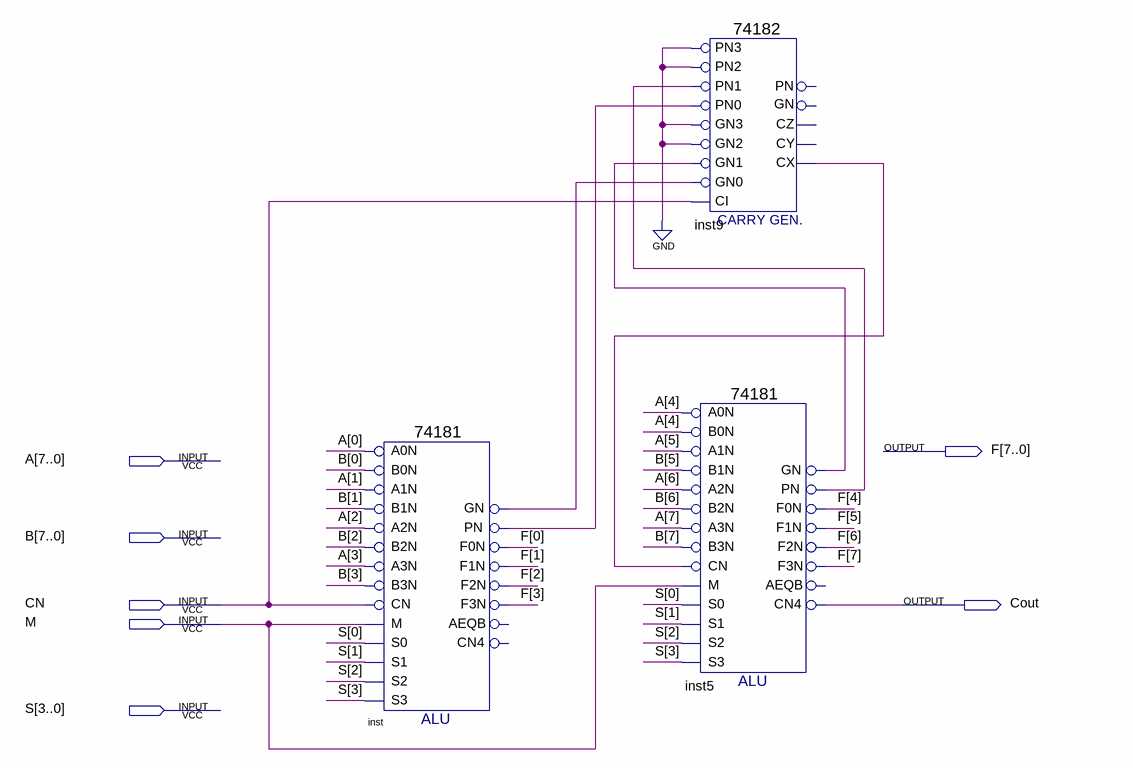
[diagram p0: schematic sheet]
// Quartus schematic ALU_8.bdf as structural Verilog: 3 symbols, 7 pins
module ALU_8 (
  input  [7:0] A,
  input  [7:0] B,
  input  CN,
  input  M,
  input  [3:0] S,
  output [7:0] F,
  output Cout
);

  wire inst5_gn, inst5_pn, inst9_cx, inst_gn, inst_pn;

  \74181  inst (
    .B0N(B[0]), .A0N(A[0]), .A1N(A[1]), .B1N(B[1]), .A3N(A[3]), .B2N(B[2]), .A2N(A[2]), .M(M), .CN(CN),
    .B3N(B[3]), .S2(S[2]), .S1(S[1]), .S0(S[0]), .S3(S[3]), .PN(inst_pn), .GN(inst_gn), .F3N(F[3]),
    .F1N(F[1]), .F0N(F[0]), .F2N(F[2]));  // open: AEQB, CN4
  \74182  inst9 (
    .PN2(1'b0), .GN2(1'b0), .GN3(1'b0), .PN3(1'b0), .CI(CN), .PN1(inst5_pn), .PN0(inst_pn), .GN1(inst5_gn),
    .GN0(inst_gn), .CX(inst9_cx));  // open: CY, PN, CZ, GN
  \74181  inst5 (
    .B0N(A[4]), .A0N(A[4]), .A1N(A[5]), .B1N(B[5]), .A3N(A[7]), .B2N(B[6]), .A2N(A[6]), .M(M), .CN(inst9_cx),
    .B3N(B[7]), .S2(S[2]), .S1(S[1]), .S0(S[0]), .S3(S[3]), .PN(inst5_pn), .GN(inst5_gn), .F3N(F[7]),
    .F1N(F[5]), .F0N(F[4]), .CN4(Cout), .F2N(F[6]));  // open: AEQB
endmodule
